# EAGLE design NRF9160ModuleEV2 (EAGLE 9.3.0)
COMPANY: ADAFRUIT INDUSTRIES; DRAWN: KTOWN; REV: A
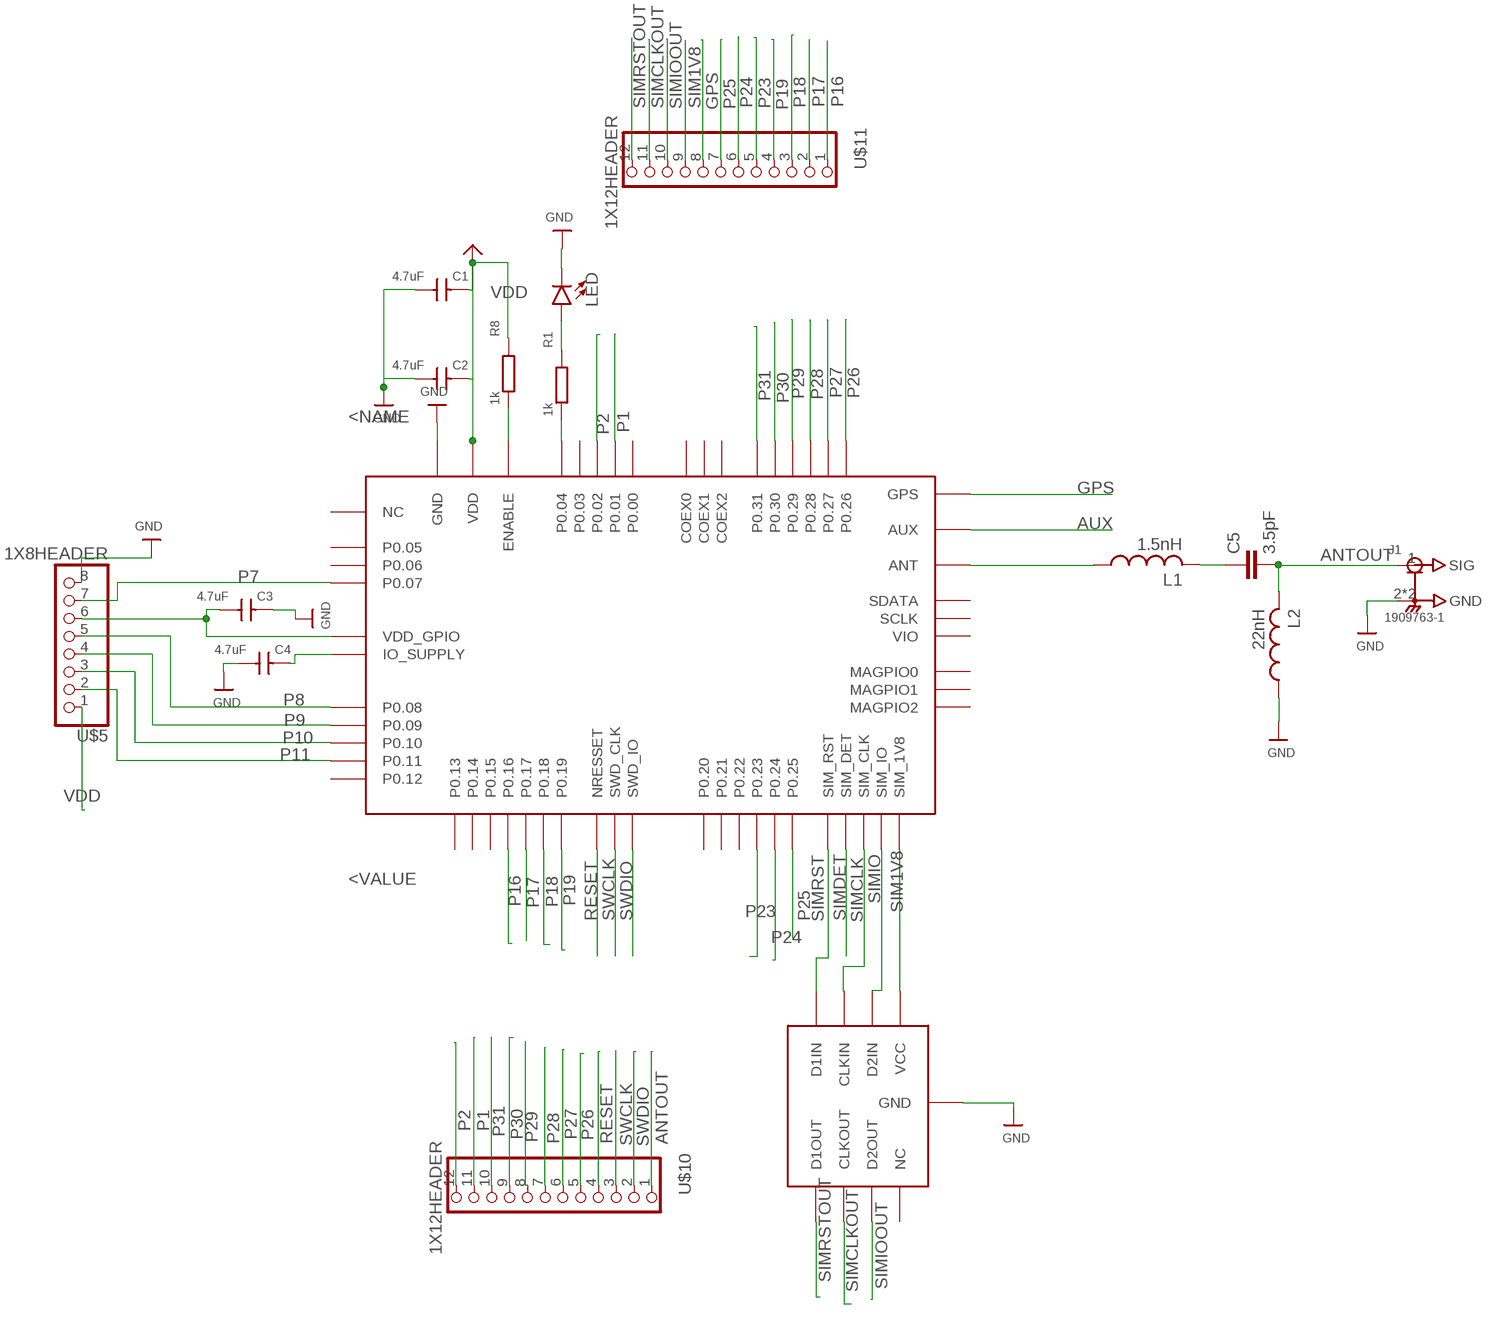
[diagram p0: schematic, sheet 1]

## Parts
C1  4.7uF  CAP0402  [C-0402]
C2  4.7uF  CAP0402  [C-0402]
C3  4.7uF  CAP0402  [C-0402]
C4  4.7uF  CAP0402  [C-0402]
C5  3.5pF  CAPACITOR_0402_N  [RESC0402_N]
IC1  NRF9160  [NRF9160]
J1  1909763-1  [TE_1909763-1]
L1  1.5nH  INDUCTOR_0603_N  [RESC0603_N]
L2  22nH  INDUCTOR_0603_N  [RESC0603_N]
LED  LED0603  [LED-0603]
R1  1k  RESR0402  [R0402]
R8  1k  RESR0402  [R0402]
U1  TPD3F303  [8-UFDFN]
U$5  1X8HEADER  [8X1]
U$10  1X12HEADER  [1X12]
U$11  1X12HEADER  [1X12]

## Nets
ANTOUT: C5.2 J1.1(SIG) L2.2 U$10.1
AUX: IC1.AUX
GND: C1.1 C2.1 C3.2 C4.1 IC1.GND@1(GND) IC1.GND@2(GND) IC1.GND@3(GND) IC1.GND@4(GND) IC1.GND@5(GND) IC1.GND@6(GND) IC1.GND@7(GND) IC1.GND@8(GND) IC1.GND@9(GND) IC1.GND@10(GND) IC1.GND@11(GND) IC1.GND@12(GND) IC1.GND@13(GND) IC1.GND@14(GND) IC1.GND@15(GND) IC1.GND@16(GND) IC1.GND@17(GND) IC1.GND@18(GND) IC1.GND@19(GND) IC1.GND@20(GND) IC1.GND@21(GND) IC1.GND@22(GND) IC1.GND@23(GND) IC1.GND@24(GND) IC1.GND@25(GND) IC1.GND@26(GND) IC1.GND@27(GND) IC1.GND@28(GND) IC1.GND@29(GND) IC1.GND@30(GND) IC1.GND@31(GND) IC1.GND@32(GND) IC1.GND@33(GND) IC1.GND@34(GND) IC1.GND@35(GND) IC1.GND_SHIELD@1(GND) IC1.GND_SHIELD@2(GND) IC1.GND_SHIELD@3(GND) IC1.GND_SHIELD@4(GND) IC1.GND_SHIELD@5(GND) IC1.GND_SHIELD@6(GND) IC1.GND_SHIELD@7(GND) IC1.GND_SHIELD@8(GND) IC1.GND_SHIELD@9(GND) IC1.GND_SHIELD@10(GND) IC1.GND_SHIELD@11(GND) IC1.GND_SHIELD@12(GND) IC1.GND_SHIELD@13(GND) IC1.GND_SHIELD@14(GND) IC1.GND_SHIELD@15(GND) IC1.GND_SHIELD@16(GND) IC1.GND_SHIELD@17(GND) IC1.GND_SHIELD@18(GND) IC1.GND_SHIELD@19(GND) IC1.GND_SHIELD@20(GND) IC1.GND_SHIELD@21(GND) IC1.GND_SHIELD@22(GND) IC1.GND_SHIELD@23(GND) IC1.GND_SHIELD@24(GND) IC1.GND_SHIELD@25(GND) IC1.GND_SHIELD@26(GND) IC1.GND_SHIELD@27(GND) IC1.GND_SHIELD@28(GND) IC1.GND_SHIELD@29(GND) IC1.GND_SHIELD@30(GND) IC1.GND_SHIELD@31(GND) IC1.GND_SHIELD@32(GND) IC1.GND_SHIELD@33(GND) IC1.GND_SHIELD@34(GND) J1.2(GND) J1.3(GND) L2.1 LED.C U1.P$9(GND) U$5.8
GPS: IC1.GPS U$11.8
N$1: IC1.ENABLE R8.2
N$2: C4.2 IC1.IO_SUPPLY
N$3: C3.1 IC1.VDD_GPIO U$5.6
N$4: IC1.P0.04 R1.2
N$5: LED.A R1.1
N$6: IC1.ANT L1.1
N$8: C5.1 L1.2
P1: IC1.P0.01 U$10.11
P2: IC1.P0.02 U$10.12
P7: IC1.P0.07 U$5.7
P8: IC1.P0.08 U$5.5
P9: IC1.P0.09 U$5.4
P10: IC1.P0.10 U$5.3
P11: IC1.P0.11 U$5.2
P16: IC1.P0.16 U$11.1
P17: IC1.P0.17 U$11.2
P18: IC1.P0.18 U$11.3
P19: IC1.P0.19 U$11.4
P23: IC1.P0.23 U$11.5
P24: IC1.P0.24 U$11.6
P25: IC1.P0.25 U$11.7
P26: IC1.P0.26 U$10.5
P27: IC1.P0.27 U$10.6
P28: IC1.P0.28 U$10.7
P29: IC1.P0.29 U$10.8
P30: IC1.P0.30 U$10.9
P31: IC1.P0.31 U$10.10
RESET: IC1.NRESET(NRESSET) U$10.4
SIM1V8: IC1.SIM_1V8 U1.VCC U$11.9
SIMCLK: IC1.SIM_CLK U1.CLKIN
SIMCLKOUT: U1.CLKOUT U$11.11
SIMDET: IC1.SIM_DET
SIMIO: IC1.SIM_IO U1.D2IN
SIMIOOUT: U1.D2OUT U$11.10
SIMRST: IC1.SIM_RST U1.D1IN
SIMRSTOUT: U1.D1OUT U$11.12
SWCLK: IC1.SWDCLK(SWD_CLK) U$10.3
SWDIO: IC1.SWDIO(SWD_IO) U$10.2
VDD: C1.2 C2.2 IC1.VDD@1(VDD) IC1.VDD@2(VDD) R8.1 U$5.1 ; supply symbol labelled VBUS
Unconnected: IC1.COEX0 IC1.COEX1 IC1.COEX2 IC1.MAGPIO0 IC1.MAGPIO1 IC1.MAGPIO2 IC1.NC1(NC) IC1.NC2(NC) IC1.NC3(NC) IC1.NC4(NC) IC1.NC5(NC) IC1.NC6(NC) IC1.NC7(NC) IC1.NC8(NC) IC1.NC9(NC) IC1.NC10(NC) IC1.NC11(NC) IC1.NC12(NC) IC1.NC13(NC) IC1.NC14(NC) IC1.NC15(NC) IC1.NC16(NC) IC1.NC17(NC) IC1.NC18(NC) IC1.NC19(NC) IC1.NC20(NC) IC1.NC21(NC) IC1.NC22(NC) IC1.NC23(NC) IC1.NC24(NC) IC1.NC25(NC) IC1.NC26(NC) IC1.NC27(NC) IC1.NC28(NC) IC1.NC29(NC) IC1.NC30(NC) IC1.NC31(NC) IC1.NC32(NC) IC1.NC33(NC) IC1.NC34(NC) IC1.NC35(NC) IC1.P0.00 IC1.P0.03 IC1.P0.05 IC1.P0.06 IC1.P0.12 IC1.P0.13 IC1.P0.14 IC1.P0.15 IC1.P0.20 IC1.P0.21 IC1.P0.22 IC1.SCLK IC1.SDATA IC1.VIO U1.NC

## Library data of the parts
C1-C4 = NANO2:CAP: CAP
C5 = NordicMisc:CAPACITOR: Generic chip capacitor
IC1 = nRF9160:NRF9160
J1 = RF Connector:1909763-1: VAO ITEM, MINI RF HEADER; COMMENT: 1909763-1; DESCRIPTION: VAO ITEM, MINI RF HEADER; DIGI-KEY_PART_NUMBER: A118077CT-ND; DIGI-KEY_PURCHASE_URL: https://www.digikey.com/product-detail/en/te-connectivity-amp-connectors/1909763-1/A118077CT-ND/4729711?utm_source=snapeda&utm_medium=aggregator&utm_campaign=symbol; MF: TE Connectivity; MP: 1909763-1; NUMBER_OF_POSITIONS: 1; PACKAGE: None; TE_PURCHASE_URL: https://www.te.com/usa-en/product-1909763-1.html?te_bu=Cor&te_type=disp&te_campaign=seda_glo_cor-seda-global-disp-prtnr-fy19-seda-model-bom-cta_sma-317_1&elqCampaignId=32493
L1 L2 = NordicMisc:INDUCTOR: Generic chip inductor
LED = SparkFun-LED:LED: LED (Generic) Standard schematic elements and footprints for 5mm, 3mm, 1206, and 0603 sized LEDs. Generic LEDs with no color specified.
R1 R8 = 1RedBeard:RES: RES
U1 = TI TPD3F303 SIM EMI Filter:TPD3F303
U$5 = Headers:1X8HEADER
U$10 U$11 = Headers:1X12HEADER

## Board
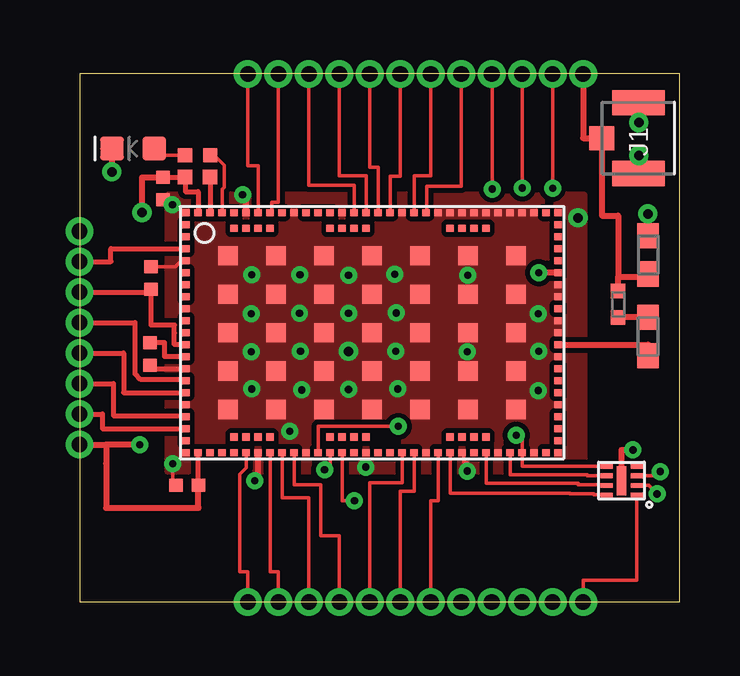
[diagram p1: board, top side]
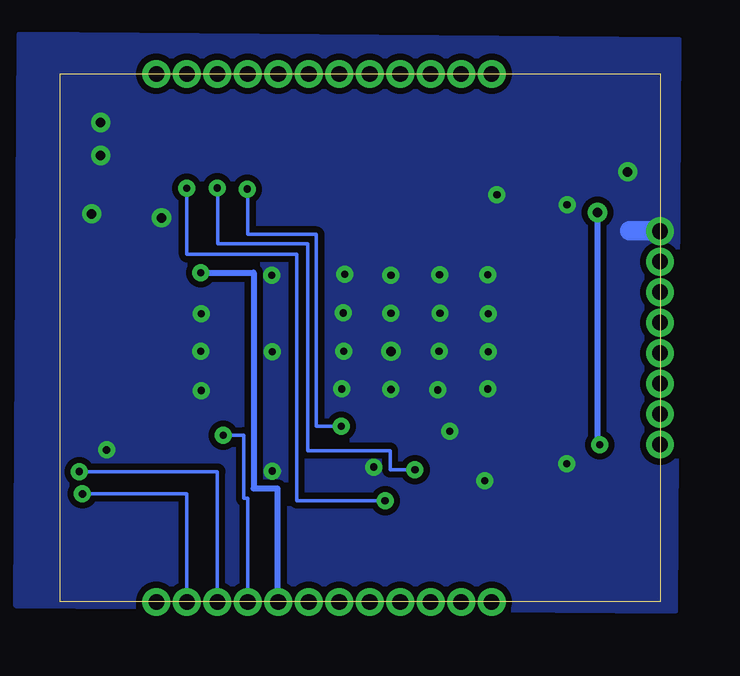
[diagram p2: board, bottom side, seen from below]

Size 25 x 22 mm. Coordinates in mm from the lower left corner, seen from the top.
Outline: 25,22 0,22 0,0 25,0 25,22
Copper layers (1*16): Top 0.035mm / dielectric 1.5mm / Bottom 0.035mm
Design rules "adafruit *": minimum track width 6mil, minimum drill 0.3mm, track to track 8mil, track to pad 8mil, pad to pad 8mil, via to via 8mil, smd to smd 0mil, copper to edge 0mil, drill to drill 8mil, minimum pad ring 10mil, minimum via ring 8mil, stop-mask expansion 2mil, vias tented up to drill 20mil, thermal gap 10mil
tRestrict: area 22.9,7.9 to 23.1,8.3; area 24.9,12.1 to 25,12.4; area 24.3,12.1 to 24.4,12.4

### Footprints (pad centres in the part's own frame; a part is rotated, then mirrored left to right if it is on the bottom)
C-0402 = smd 0.55 x 0.55: 1 -0.47,0; 2 0.47,0
RESC0402_N = smd 0.6 x 0.6: 1 -0.55,0; 2 0.55,0
NRF9160 = smd 0.3 x 0.3: ANT 15.75,4.75; AUX 15.75,6.25; COEX0 5.25,10.25; COEX1 5.75,10.25; COEX2 6.25,10.25; ENABLE 1.25,10.25; GND_SHIELD@1 0.25,10.25; GND_SHIELD@2 0.25,8.25; GND_SHIELD@3 0.25,6.25; GND_SHIELD@4 0.25,3.75; GND_SHIELD@5 0.25,2.25; GND_SHIELD@6 0.25,0.25; GND_SHIELD@7 3.25,0.25; GND_SHIELD@8 5.25,0.25; GND_SHIELD@9 7.75,0.25; GND_SHIELD@10 10.25,0.25; GND_SHIELD@11 11.75,0.25; GND_SHIELD@12 13.25,0.25; GND_SHIELD@13 14.75,0.25; GND_SHIELD@14 15.75,0.25; GND_SHIELD@15 15.75,2.25; GND_SHIELD@16 15.75,4.25; GND_SHIELD@17 15.75,5.25; GND_SHIELD@18 15.75,5.75; GND_SHIELD@19 15.75,6.75; GND_SHIELD@20 15.75,7.25; GND_SHIELD@21 15.75,10.25; GND_SHIELD@22 14.75,10.25; GND_SHIELD@23 14.25,10.25; GND_SHIELD@24 13.75,10.25; GND_SHIELD@25 13.25,10.25; GND_SHIELD@26 12.75,10.25; GND_SHIELD@27 12.25,10.25; GND_SHIELD@28 11.75,10.25; GND_SHIELD@29 11.25,10.25; GND_SHIELD@30 10.75,10.25; GND_SHIELD@31 9.25,10.25; GND_SHIELD@32 6.75,10.25; GND_SHIELD@33 4.75,10.25; GND_SHIELD@34 2.75,10.25; GPS 15.75,7.75; IO_SUPPLY 0.25,4.25; MAGPIO0 15.75,1.75; MAGPIO1 15.75,1.25; MAGPIO2 15.75,0.75; NC1 0.25,7.75; NC2 0.25,7.25; NC3 0.25,6.75; NC4 0.25,5.75; NC5 0.25,5.25; NC6 15.25,0.25; NC7 15.75,8.25; NC8 15.75,8.75; NC9 15.75,9.25; NC10 15.75,9.75; NC11 15.25,10.25; NC12 2.25,0.9; NC13 2.75,0.9; NC14 3.25,0.9; NC15 3.75,0.9; NC16 6.25,0.9; NC17 6.75,0.9; NC18 7.25,0.9; NC19 7.75,0.9; NC20 11.25,0.9; NC21 11.75,0.9; NC22 12.25,0.9; NC23 12.75,0.9; NC24 12.75,9.6; NC25 12.25,9.6; NC26 11.75,9.6; NC27 11.25,9.6; NC28 7.75,9.6; NC29 7.25,9.6; NC30 6.75,9.6; NC31 6.25,9.6; NC32 3.75,9.6; NC33 3.25,9.6; NC34 2.75,9.6; NC35 2.25,9.6; NRESET 5.75,0.25; P0.00 4.25,10.25; P0.01 3.75,10.25; P0.02 3.25,10.25; P0.03 2.25,10.25; P0.04 1.75,10.25; P0.05 0.25,9.75; P0.06 0.25,9.25; P0.07 0.25,8.75; P0.08 0.25,3.25; P0.09 0.25,2.75; P0.10 0.25,1.75; P0.11 0.25,1.25; P0.12 0.25,0.75; P0.13 1.25,0.25; P0.14 1.75,0.25; P0.15 2.25,0.25; P0.16 2.75,0.25; P0.17 3.75,0.25; P0.18 4.25,0.25; P0.19 4.75,0.25; P0.20 7.25,0.25; P0.21 8.25,0.25; P0.22 8.75,0.25; P0.23 9.25,0.25; P0.24 9.75,0.25; P0.25 10.75,0.25; P0.26 10.25,10.25; P0.27 9.75,10.25; P0.28 8.75,10.25; P0.29 8.25,10.25; P0.30 7.75,10.25; P0.31 7.25,10.25; SCLK 15.75,3.25; SDATA 15.75,3.75; SIM_1V8 14.25,0.25; SIM_CLK 12.75,0.25; SIM_DET 12.25,0.25; SIM_IO 13.75,0.25; SIM_RST 11.25,0.25; SWDCLK 6.25,0.25; SWDIO 6.75,0.25; VDD@1 0.75,0.25; VDD@2 0.75,10.25; VDD_GPIO 0.25,4.75; VIO 15.75,2.75 | smd 0.8 x 0.8: GND@1 2,8.45; GND@2 4,8.45; GND@3 6,8.45; GND@4 8,8.45; GND@5 10,8.45; GND@6 12,8.45; GND@7 14,8.45; GND@8 2,6.85; GND@9 4,6.85; GND@10 6,6.85; GND@11 8,6.85; GND@12 10,6.85; GND@13 12,6.85; GND@14 14,6.85; GND@15 2,5.25; GND@16 4,5.25; GND@17 6,5.25; GND@18 8,5.25; GND@19 10,5.25; GND@20 12,5.25; GND@21 14,5.25; GND@22 2,3.65; GND@23 4,3.65; GND@24 6,3.65; GND@25 8,3.65; GND@26 10,3.65; GND@27 12,3.65; GND@28 14,3.65; GND@29 2,2.05; GND@30 4,2.05; GND@31 6,2.05; GND@32 8,2.05; GND@33 10,2.05; GND@34 12,2.05; GND@35 14,2.05
TE_1909763-1 = smd 1 x 1.05: 1 0,-1.525 | smd 1.05 x 2.2: 2 -1.475,0; 3 1.475,0
RESC0603_N = smd 1.05 x 0.9: 1 -0.8,0; 2 0.8,0
LED-0603 = smd 1 x 1: A -0.877,0; C 0.877,0
R0402 = smd 0.6 x 0.6: 1 -0.525,0; 2 0.525,0
8-UFDFN = smd 0.2 x 0.5: CLKIN 0.2,-0.625; CLKOUT 0.2,0.625; D1IN 0.6,-0.625; D1OUT 0.6,0.625; D2IN -0.2,-0.625; D2OUT -0.2,0.625; NC -0.6,0.625; VCC -0.6,-0.625 | smd 1.2 x 0.4: P$9 0,0
8X1 = drill 0.65: 1 -4.445,0; 2 -3.175,0; 3 -1.905,0; 4 -0.635,0; 5 0.635,0; 6 1.905,0; 7 3.175,0; 8 4.445,0
1X12 = drill 0.65: 1 -6.985,0; 2 -5.715,0; 3 -4.445,0; 4 -3.175,0; 5 -1.905,0; 6 -0.635,0; 7 0.635,0; 8 1.905,0; 9 3.175,0; 10 4.445,0; 11 5.715,0; 12 6.985,0

### Placement (x,y rotation side)
C1  3.47,17.22 90 top
C2  4.49,4.86 0 top
C3  2.98,13.49 90 top
C4  2.94,10.33 90 top
C5  22.44,12.41 90 top
IC1  4.19,5.97 0 top
J1  23.29,19.33 270 top
L1  23.69,11.06 90 top
L2  23.69,14.46 270 top
LED  2.23,18.89 180 top
R1  4.92,18.61 0 top
R8  4.92,17.7 0 top
U1  22.58,5.05 270 top
U$5  0,11 90 top
U$10  14,22 180 top
U$11  14,0 0 top

### Tracks (layer width: path | path; a pad name or v marks a point on that pad's centre or on a via)
ANTOUT
  Top 0.254: C5.2 22.44,13.54 | 22.44,13.54 22.44,16.09 21.77,16.09 J1.1 20.98,19.33 U$10.1 | L2.2 23.7,13.54 22.44,13.54
GND  (via drill 0.3, 0.39)
  Top 0.152: C2.1 3.88,4.86 v3.88,5.75 | C1.1 3.87,16.75 v3.87,16.54 | IC1.GND_SHIELD@11 16.01,6.22 16.01,5.79 16.16,5.79 v16.16,5.45 | LED.C 0.92,18.89 | IC1.GND_SHIELD@2 4.37,14.15 4.17,14.15 3.99,13.96 C3.2
  Top 0.203: C4.1 2.94,9.72 IC1.GND_SHIELD@4
  Top 0.254: U1.P$9 22.58,6.33 v23.06,6.33 | v7.3,5.05 7.44,5.05 IC1.GND_SHIELD@7 | IC1.GND_SHIELD@34 6.94,16.96 v6.79,16.96 | v23.68,16.17 23.7,16.17 L2.1 | LED.C 1.35,18.89 v1.35,17.92 | J1.2 23.3,20.8 v23.3,19.97 | J1.3 23.3,17.85 v23.3,18.6
  Bottom 0.254: v16.16,5.45 15.9,5.45
  Bottom 0.813: U$5.8 1.27,15.46
  other vias: 11.21,10.44 20.77,16 8.76,7.11 11.93,5.62 19.11,12 19.11,8.81 16.18,13.61 16.16,10.42 13.14,13.65 7.18,13.63 9.19,13.63 11.21,13.61 7.16,12 9.17,12.02 11.21,12.02 13.2,12.04 13.18,10.45 13.26,8.87 19.14,10.45 9.21,10.45 7.16,10.43 7.18,8.87 9.26,8.83 11.21,8.85
  pour Bottom (isolate 0.254, no thermals): -0.78,23.4 26.69,23.63 26.83,-0.13 -0.64,-0.37
  pour Top (no thermals): 21.05,16.96 3.66,16.96 3.66,5.44 21.05,5.44
GPS  (via drill 0.3)
  Top 0.254: IC1.GPS v19.13,13.72
  Bottom 0.254: v19.13,13.72 16.93,13.72 16.93,4.72 15.93,4.72 15.93,0 U$11.8
N$1
  Top 0.203: R8.2 IC1.ENABLE
N$2
  Top 0.203: IC1.IO_SUPPLY 3.55,10.22 3.55,10.8 C4.2
N$3
  Top 0.152: C3.1
  Top 0.203: U$5.6 2.98,12.9 C3.1 2.98,11.53 3.96,11.53 3.96,11.21 3.96,10.72 IC1.VDD_GPIO
N$4
  Top 0.152: IC1.P0.04 5.94,17.2 6.02,17.28 6.02,18.19 5.61,18.61 R1.2
N$5
  Top 0.152: R1.1 3.11,18.61 LED.A
N$6
  Top 0.254: IC1.ANT 23.69,10.72 L1.1
N$8
  Top 0.254: L1.2 C5.1
P1
  Top 0.152: IC1.P0.01 8.01,16.22 8.01,16.65 8.29,16.65 U$10.11
P2
  Top 0.152: IC1.P0.02 7.44,18.17 7.01,18.17 7.01,19.22 | U$10.12 7.01,19.22 | 7.01,19.22
P7
  Top 0.203: IC1.P0.07 1.31,14.72 1.31,14.18 U$5.7
P8
  Top 0.203: IC1.P0.08 4.39,9.26 2.55,9.26 2.31,9.5 2.31,11.63 U$5.5
P9
  Top 0.203: U$5.4 1.83,10.37 1.83,8.72 IC1.P0.09
P10
  Top 0.203: IC1.P0.10 4.39,7.76 1.41,7.76 1.41,9.1 U$5.3
P11
  Top 0.203: U$5.2 0.95,7.83 0.95,7.22 IC1.P0.11
P16
  Top 0.152: IC1.P0.16 6.94,5.59 6.67,5.32 6.67,1.25 7.01,1.25 U$11.1
P17
  Top 0.152: IC1.P0.17 7.94,1.25 8.29,1.25 U$11.2
P18
  Top 0.152: IC1.P0.18 8.44,4.34 9.55,4.34 U$11.3
P19
  Top 0.152: U$11.4 10.82,2.76 10.06,2.76 10.06,4.88 8.94,4.88 IC1.P0.19
P23
  Top 0.152: IC1.P0.23 13.44,4.96 12.1,4.96 U$11.5
P24
  Top 0.152: IC1.P0.24 13.94,4.6 13.37,4.6 U$11.6
P25
  Top 0.152: IC1.P0.25 14.94,4.21 14.63,4.21 U$11.7
P26
  Top 0.152: IC1.P0.26 14.46,16.22 14.46,17.32 15.9,17.32 U$10.5
P27
  Top 0.152: 14.01,16.22 IC1.P0.27 13.94,17.75 14.55,17.75 14.63,17.75 U$10.6
P28
  Top 0.152: 13.01,16.22 IC1.P0.28 12.94,17.74 13.37,17.74 U$10.7
P29
  Top 0.152: IC1.P0.29 12.44,18.11 12.09,18.11 12.09,19.14 | 12.09,19.14 12.09,19.22 | U$10.8 | U$10.8 12.1,19.14 12.09,19.14
P30
  Top 0.152: IC1.P0.30 11.94,17.76 10.82,17.76 10.82,19.22 U$10.9
P31
  Top 0.152: IC1.P0.31 11.44,17.36 9.55,17.36 9.55,19.12 | 9.55,19.12 9.55,19.22 | U$10.10 9.55,19.12
RESET  (via drill 0.3)
  Top 0.152: IC1.NRESET 9.94,7.31 v13.29,7.31 | U$10.4 17.2,21.98 v17.2,17.2
  Bottom 0.152: v17.2,17.2 17.18,17.18 17.18,15.32 14.32,15.32 14.32,7.32 13.29,7.32 v13.29,7.31
SIM1V8  (via drill 0.3)
  Top 0.152: U1.VCC 18.44,5.65 IC1.SIM_1V8 18.44,6.95 v18.2,6.95
  Bottom 0.152: v18.2,6.95 17.33,6.95 17.33,4.31 17.18,4.31 U$11.9
SIMCLK
  Top 0.152: IC1.SIM_CLK 16.94,4.94 20.79,4.94 20.79,4.87 21.96,4.87 U1.CLKIN
SIMCLKOUT  (via drill 0.3)
  Top 0.152: 23.23,4.83 U1.CLKOUT 23.71,4.85 v24.07,4.5
  Bottom 0.152: v24.07,4.5 19.71,4.5 U$11.11
SIMIO
  Top 0.152: IC1.SIM_IO 17.94,5.3 21.15,5.3 21.15,5.25 U1.D2IN
SIMIOOUT  (via drill 0.3)
  Top 0.152: U1.D2OUT 24.02,5.25 v24.2,5.43
  Bottom 0.152: v24.2,5.43 18.45,5.43 U$11.10
SIMRST
  Top 0.152: 15.37,6.15 IC1.SIM_RST 15.44,4.53 20.43,4.53 20.43,4.52 21.43,4.52 21.43,4.47 21.96,4.47 U1.D1IN
SIMRSTOUT
  Top 0.152: U1.D1OUT 23.21,0.9 20.98,0.9 U$11.12
SWCLK  (via drill 0.3)
  Top 0.152: IC1.SWDCLK 10.44,5.51 v10.21,5.51 | v18.45,17.25 U$10.3
  Bottom 0.152: v10.21,5.51 11.25,5.51 11.25,6.3 14.68,6.3 14.68,14.91 18.43,14.91 18.43,17.23 v18.45,17.25
SWDIO  (via drill 0.3)
  Top 0.152: IC1.SWDIO 10.94,4.21 v11.46,4.21 | v19.71,17.23 v19.71,17.24 U$10.2
  Bottom 0.152: v11.46,4.21 15.13,4.21 15.13,14.48 19.71,14.48 v19.71,17.23
VDD  (via drill 0.3, 0.39)
  Top 0.203: R8.1 | R8.1 4.41,17.7 4.41,17.09 4.94,17.09 IC1.VDD@2 | C2.2 4.96,4.9 4.96,6.2 IC1.VDD@1 | C1.2 R8.1
  Top 0.254: v2.6,16.23 2.6,17.69 C1.2 | 4.96,4.9 4.96,3.93 4.97,3.92 1.11,3.92 1.11,5.77 1.11,6.55 | U$5.1 1.11,6.55 | v2.51,6.55 1.11,6.55
  Bottom 0.254: v2.51,6.55 2.6,6.55 v2.6,16.23